# EasyEDA Pro project codeday-badge.eprj, schematic CodeDay Badge

## Sheets
1 RF: Create Date: 2023-02-03; Page Name: RF; Project Name: codeday-badge; Schematic Name: CodeDay Badge; Update Date: 2023-03-01; Company: EasyEDA.com; Drawed: EasyEDA Pro; Page Size: A4; Part Number: JLCPCB-002; Reviewed: EasyEDA Pro; Version: V0.1
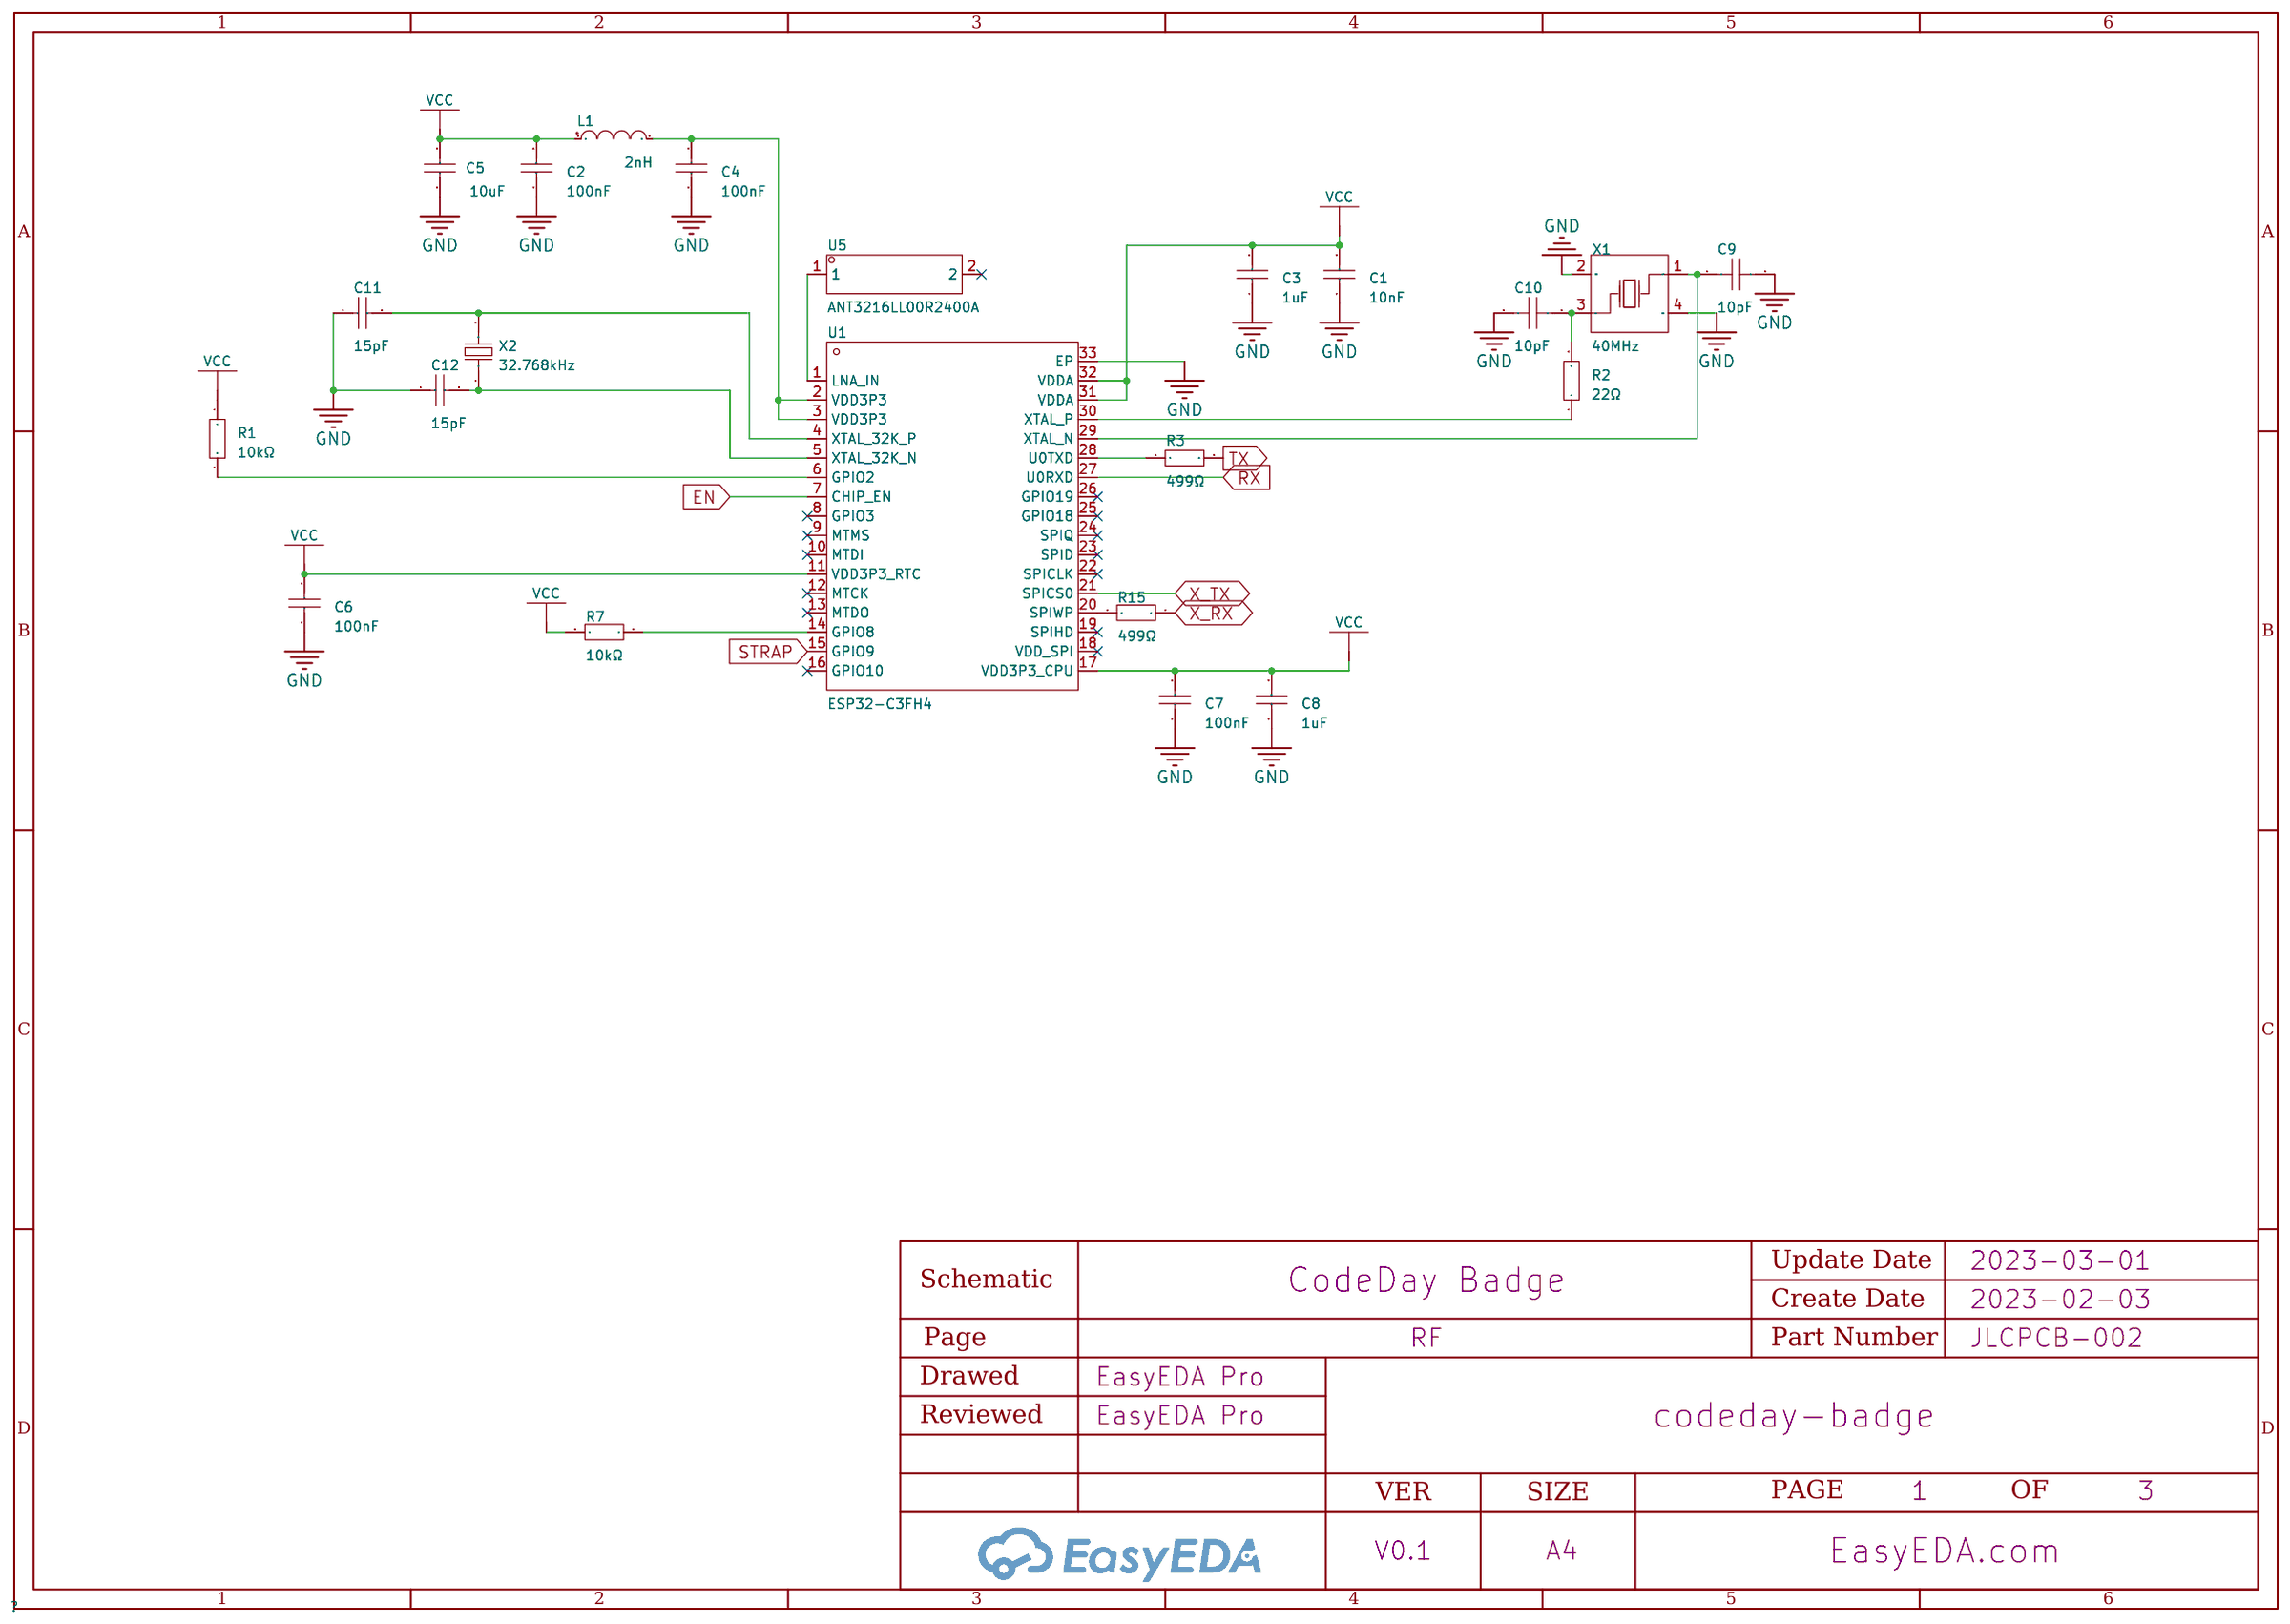
[diagram p0: RF]
2 LED: Create Date: 2023-02-28; Page Name: LED; Company: CQP LLC; Drawed: Tyler Menezes; Reviewed: Tyler Menezes; Version: V1.0
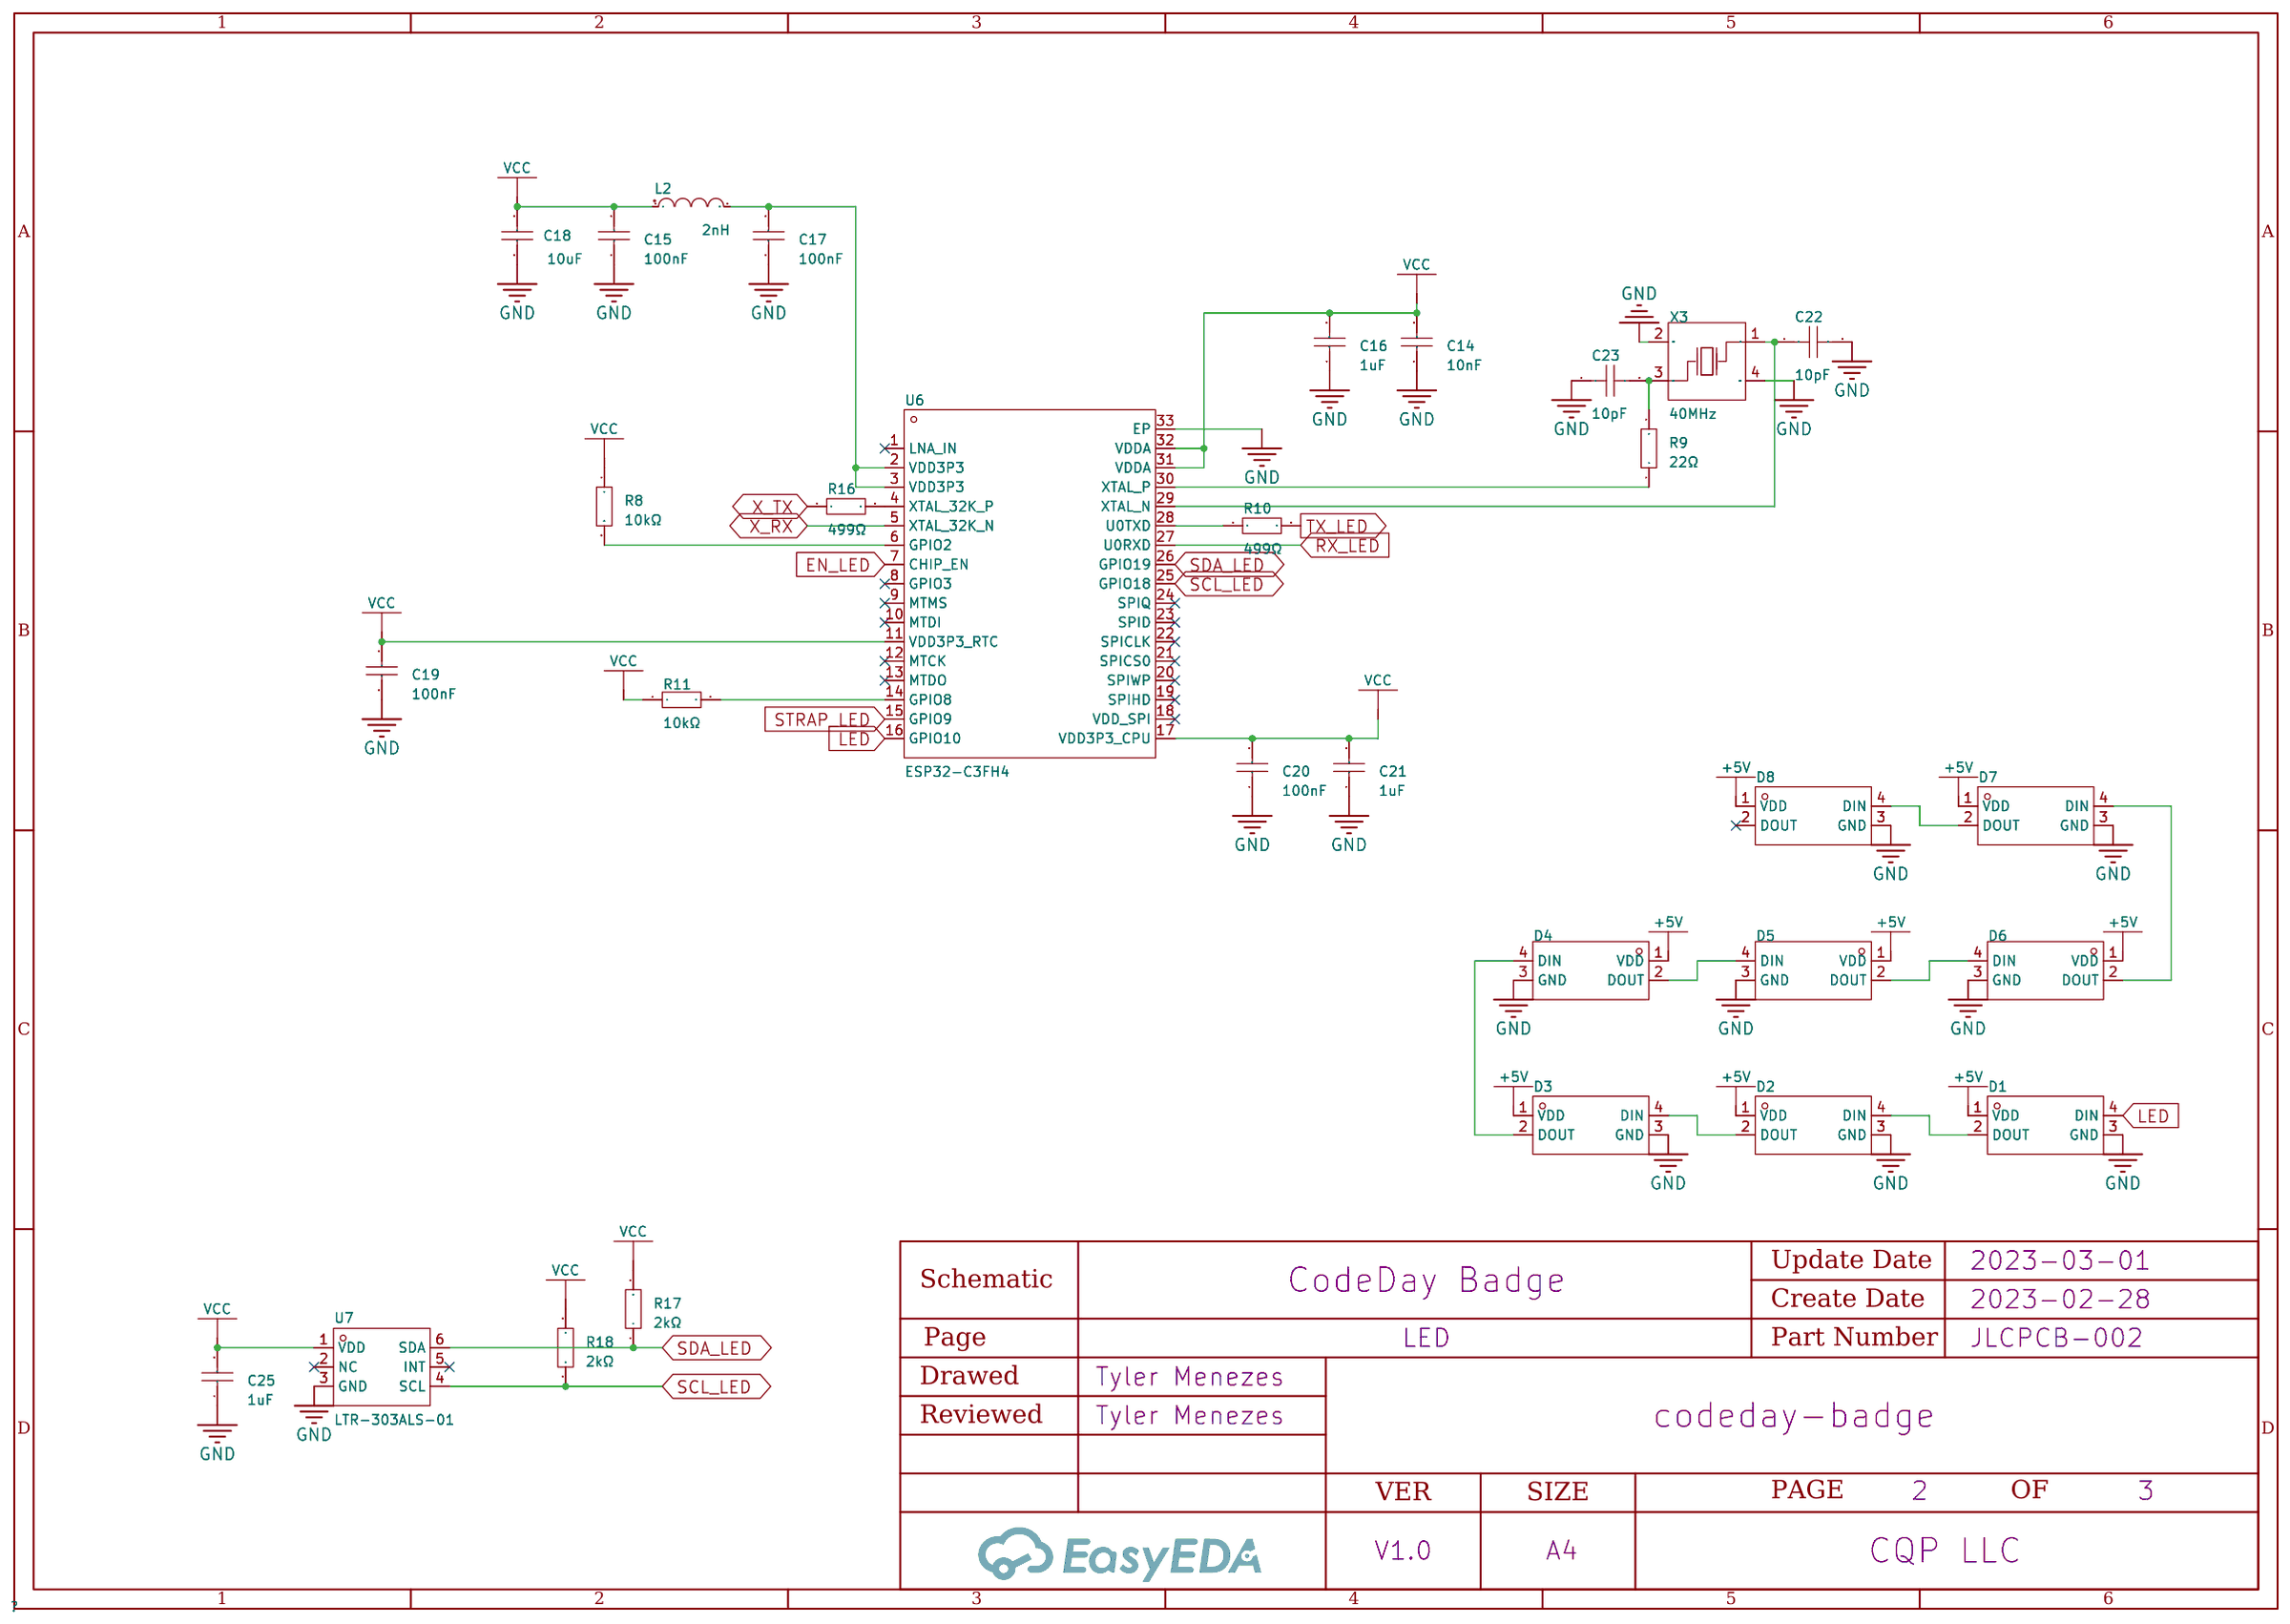
[diagram p1: LED]
3 IO Power: Create Date: 2023-03-01; Page Name: IO Power; Company: CQP LLC; Drawed: Tyler Menezes; Reviewed: Tyler Menezes; Version: V1.0
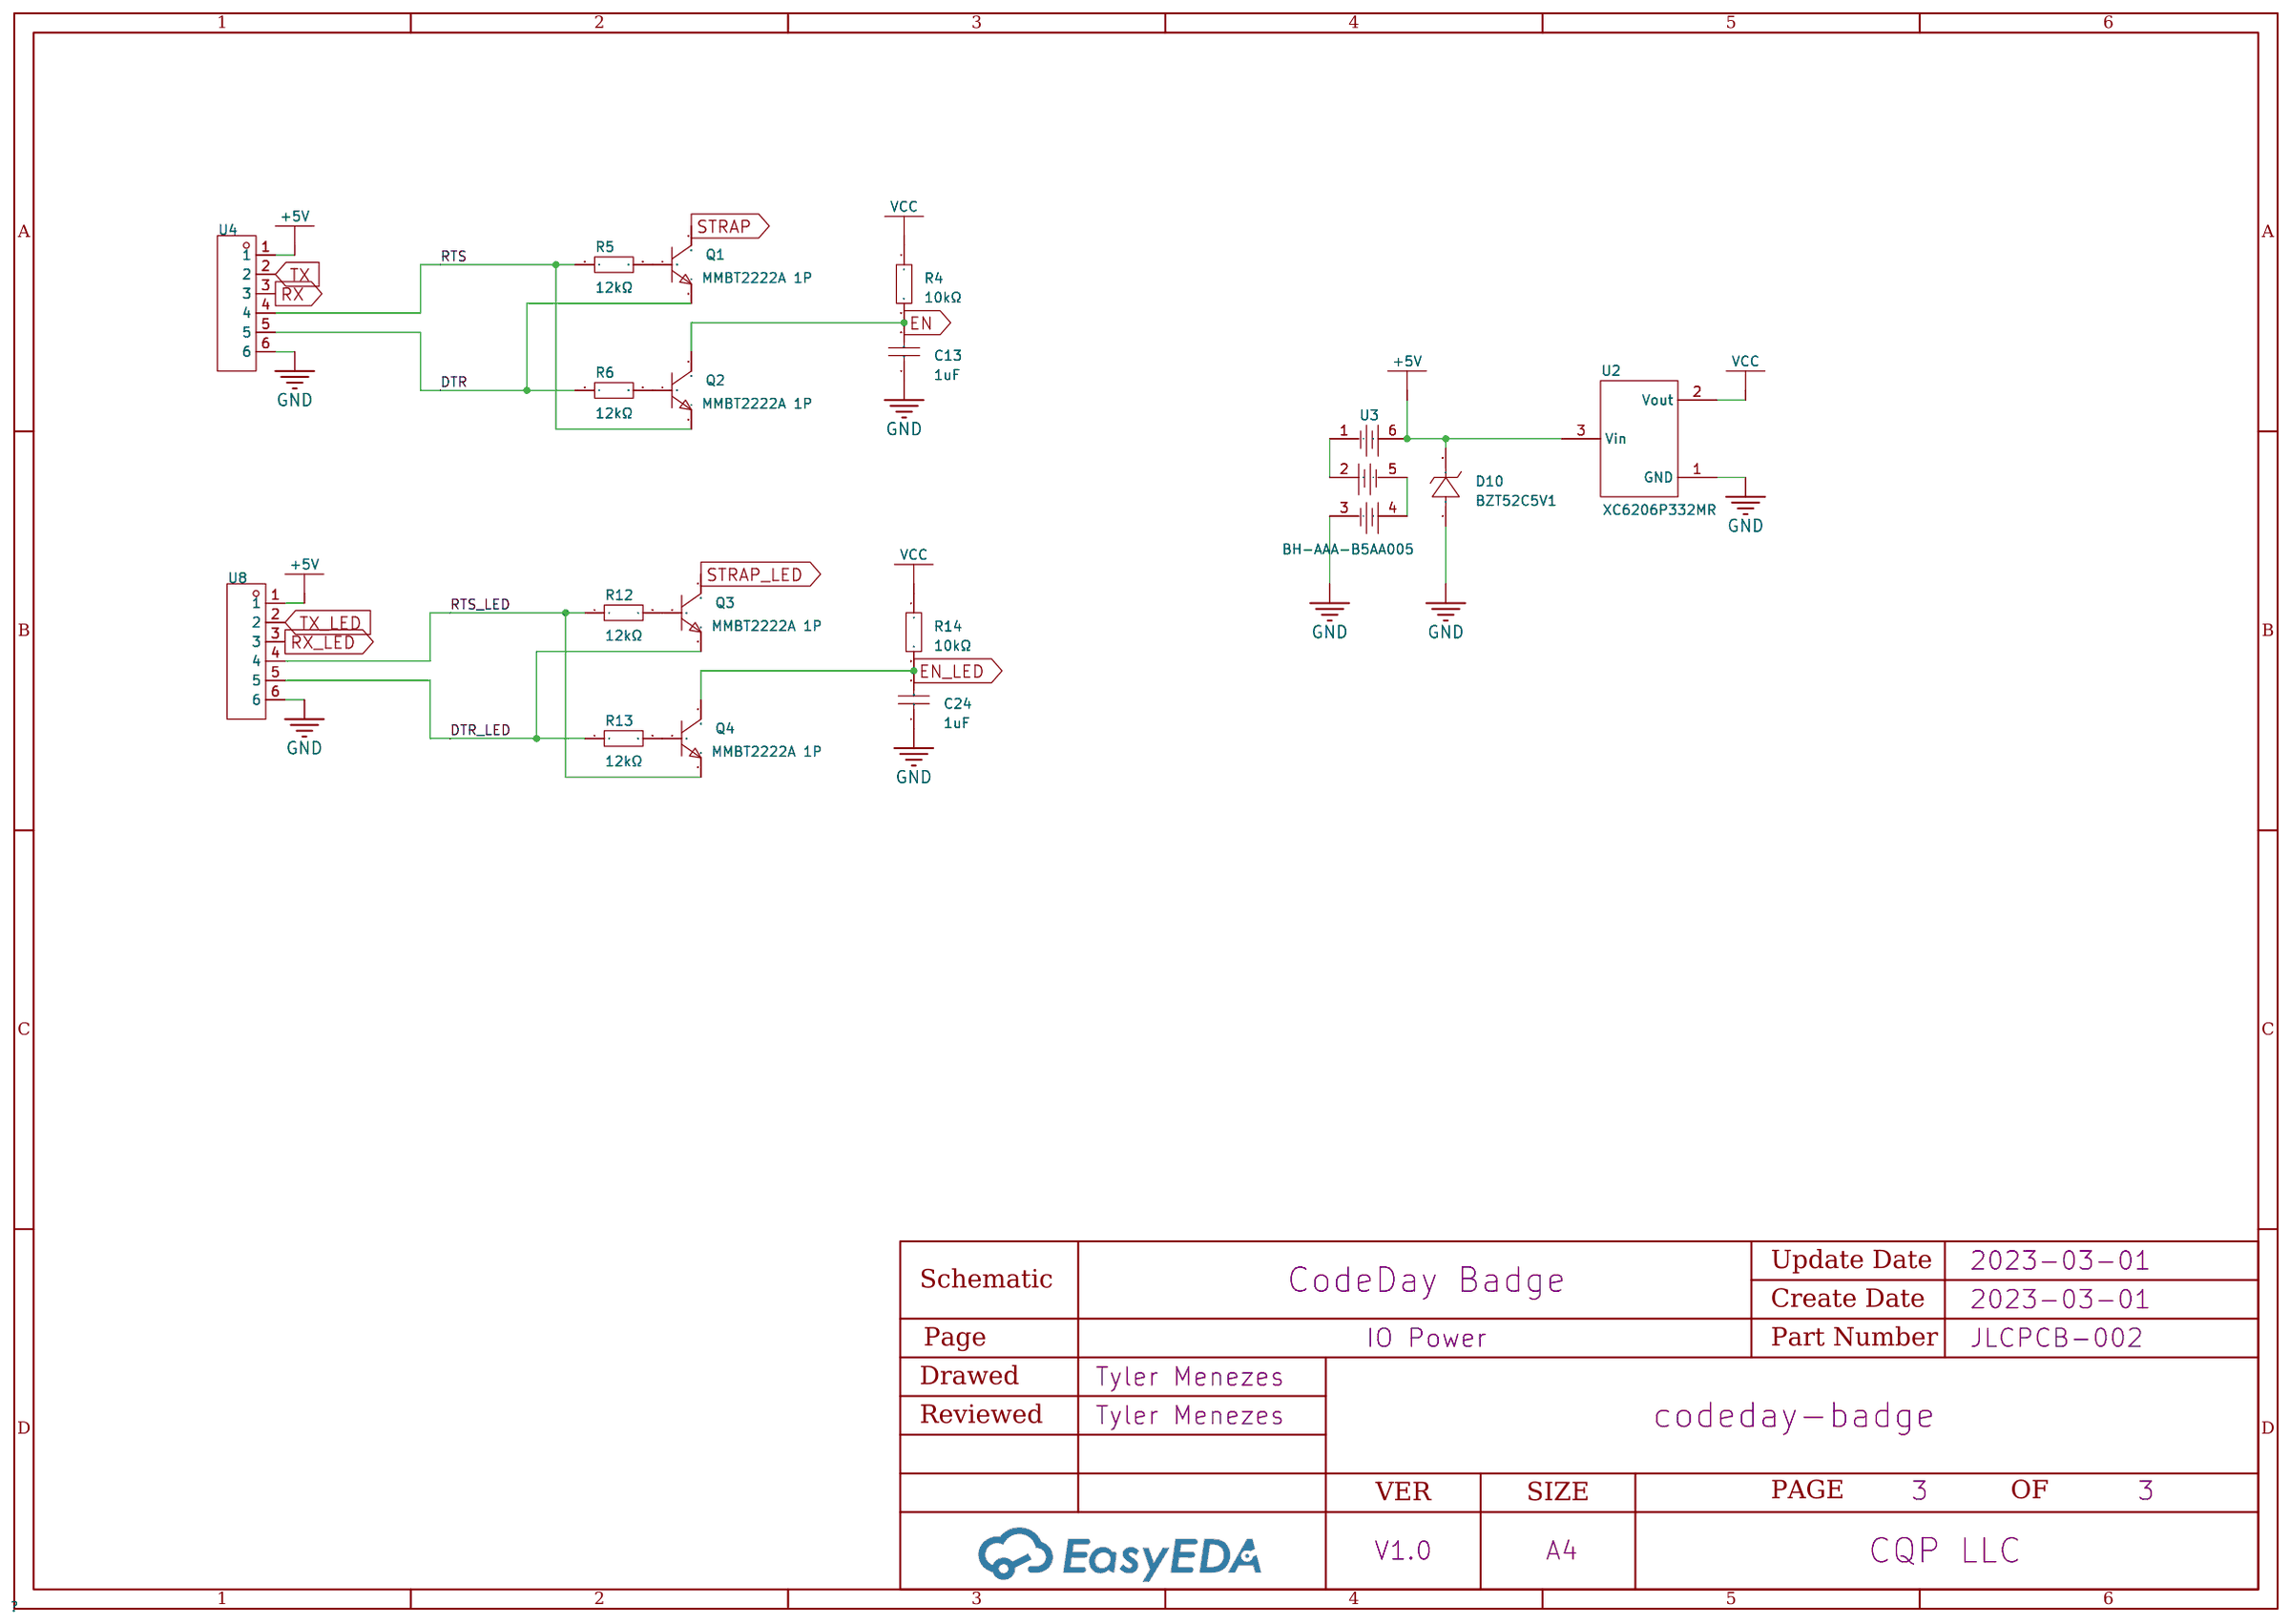
[diagram p2: IO Power]

## Parts
sheet IO Power
C13  1uF  [C0603]
C24  1uF  [C0603]
D10  BZT52C5V1  [SOD-123_L2.7-W1.6-LS3.7-R-RD]
Q1  MMBT2222A 1P  [SOT-23-3_L2.9-W1.3-P1.90-LS2.4-BR]
Q2  MMBT2222A 1P  [SOT-23-3_L2.9-W1.3-P1.90-LS2.4-BR]
Q3  MMBT2222A 1P  [SOT-23-3_L2.9-W1.3-P1.90-LS2.4-BR]
Q4  MMBT2222A 1P  [SOT-23-3_L2.9-W1.3-P1.90-LS2.4-BR]
R4  10kΩ  [R0402]
R5  12kΩ  [R0402]
R6  12kΩ  [R0402]
R12  12kΩ  [R0402]
R13  12kΩ  [R0402]
R14  10kΩ  [R0402]
U2  XC6206P332MR  [SOT-23-3_L2.9-W1.6-P1.90-LS2.8-BR]
U3  BH-AAA-B5AA005  [BAT-SMD_BH-AAA-B5AA005]
U4  ad8fa1fdb8d44eac8dc13500dd650be4  [HDR-TH_6P-P2.54-V-M-A]
U8  ad8fa1fdb8d44eac8dc13500dd650be4  [HDR-TH_6P-P2.54-V-M-A]
sheet LED
C14  10nF  [C0402]
C15  100nF  [C0402_NEW]
C16  1uF  [C0603]
C17  100nF  [C0402_NEW]
C18  10uF  [C0402]
C19  100nF  [C0402_NEW]
C20  100nF  [C0402_NEW]
C21  1uF  [C0603]
C22  10pF  [C0402]
C23  10pF  [C0402]
C25  1uF  [C0603]
D1  XL-0807RGBC-WS2812B  [LED-SMD_4P-L2.0-W1.8_CY-0807]
D2  XL-0807RGBC-WS2812B  [LED-SMD_4P-L2.0-W1.8_CY-0807]
D3  XL-0807RGBC-WS2812B  [LED-SMD_4P-L2.0-W1.8_CY-0807]
D4  XL-0807RGBC-WS2812B  [LED-SMD_4P-L2.0-W1.8_CY-0807]
D5  XL-0807RGBC-WS2812B  [LED-SMD_4P-L2.0-W1.8_CY-0807]
D6  XL-0807RGBC-WS2812B  [LED-SMD_4P-L2.0-W1.8_CY-0807]
D7  XL-0807RGBC-WS2812B  [LED-SMD_4P-L2.0-W1.8_CY-0807]
D8  XL-0807RGBC-WS2812B  [LED-SMD_4P-L2.0-W1.8_CY-0807]
L2  2nH  [L0402-RD]
R8  10kΩ  [R0402]
R9  22Ω  [R0603]
R10  499Ω  [R0402]
R11  10kΩ  [R0402]
R16  499Ω  [R0402]
R17  2kΩ  [R0402]
R18  2kΩ  [R0402]
U6  ESP32-C3FH4  [QFN-32_L5.0-W5.0-P0.50-TL-EP3.7]
U7  LTR-303ALS-01  [SOT-363_L2.0-W1.3-P0.65-LS2.1-BL]
X3  40MHz  [CRYSTAL-SMD_4P-L2.5-W2.0-BL]
sheet RF
C1  10nF  [C0402]
C2  100nF  [C0402_NEW]
C3  1uF  [C0603]
C4  100nF  [C0402_NEW]
C5  10uF  [C0402]
C6  100nF  [C0402_NEW]
C7  100nF  [C0402_NEW]
C8  1uF  [C0603]
C9  10pF  [C0402]
C10  10pF  [C0402]
C11  15pF  [C0603]
C12  15pF  [C0603]
L1  2nH  [L0402-RD]
R1  10kΩ  [R0402]
R2  22Ω  [R0603]
R3  499Ω  [R0402]
R7  10kΩ  [R0402]
R15  499Ω  [R0402]
U1  ESP32-C3FH4  [QFN-32_L5.0-W5.0-P0.50-TL-EP3.7]
U5  ANT3216LL00R2400A  [ANT-SMD_L3.2-W1.6]
X1  40MHz  [CRYSTAL-SMD_4P-L2.5-W2.0-BL]
X2  32.768kHz  [FC-135R_L3.2-W1.5]

## Library data of the parts
C3 C8 C13 C16 C21 C24 C25 = CL10A105KB8NNNC: Capacitance: Tolerance:±10% Tolerance:±10% Voltage Rated: Temperature Coefficient:; LCSC Part Name: 1uF ±10% 50V; Supplier Part: C15849; Manufacturer: SAMSUNG(三星); Supplier Footprint: 0603; Datasheet: https://atta.szlcsc.com/upload/public/pdf/source/20160103/1457707679084.pdf; Supplier: LCSC; Tolerance: ±10%; Check: true
D10 = BZT52C5V1_C2891773: Diode Configuration:- Zener Voltage (Nom):5.1V Zener Voltage (Range):5.1V~5.4V Zener Voltage (Range):5.1V~5.4V Power Dissipation:500mW Reverse Leakage Current (Ir):2uA@2V Zener Impedance (Zzt):60Ω; LCSC Part Name: 5.1V 500mW; Supplier Part: C2891773; Manufacturer: YONGYUTAI(永裕泰); Supplier Footprint: SOD-123; JLCPCB Part Class: Extended Part; Datasheet: https://atta.szlcsc.com/upload/public/pdf/source/20210901/8FC2376A01E96D0346FF8B134DC7A446.pdf; Supplier: LCSC; Zener Voltage (Nom): 5.1V; Zener Voltage (Range): 5.1V~5.4V; Power Dissipation: 500mW; Reverse Leakage Current (Ir): 2uA@2V; Zener Impedance (Zzt): 60Ω
Q1-Q4 = MMBT2222A 1P_C8512: Transistor Type: Collector-Emitter Breakdown Voltage (Vceo): Collector Current (Ic): Power Dissipation (Pd): Collector Cut-Off Current (Icbo):10nA Collector-Emitter Saturation Voltage (VCE(sat)@Ic,Ib):1V@500mA,50mA Transition Frequency (fT):300MHz Operati; LCSC Part Name: NPN 40V 600mA; Supplier Part: C8512; Manufacturer: CJ(江苏长电/长晶); Supplier Footprint: SOT-23; JLCPCB Part Class: Basic Part; Datasheet: https://atta.szlcsc.com/upload/public/pdf/source/20140815/1457707223705.pdf; Supplier: LCSC; Collector Cut-Off Current (Icbo): 10nA; Collector-Emitter Saturation Voltage (VCE(sat)@Ic,Ib): 1V@500mA,50mA; Transition Frequency (fT): 300MHz; Operating Temperature: +150℃@(Tj)
R1 R4 R7 R8 R11 R14 = 0402WGF1002TCE: Type:Thick Film Resistors Resistance: Tolerance:±1% Tolerance:±1% Power(Watts): Temperature Coefficient:±100ppm/℃ Temperature Coefficient:±100ppm/℃ Overload Voltage (Max): Operating Temperature Range:-55℃~+155℃ Operating Temperature Range:-55℃~+155℃; LCSC Part Name: 10kΩ ±1% 62.5mW; Supplier Part: C25744; Manufacturer: UNI-ROYAL(厚声); Supplier Footprint: 0402; Datasheet: https://atta.szlcsc.com/upload/public/pdf/source/20200306/C422600_1E6D84923E4A46A82E41ADD87F860B5C.pdf; Supplier: LCSC; Type: Thick Film Resistors; Tolerance: ±1%; Temperature Coefficient: ±100ppm/℃; Operating Temperature Range: -55℃~+155℃; Check: true
R5 R6 R12 R13 = 0402WGF1202TCE: Type:Thick Film Resistors Resistance: Tolerance:±1% Tolerance:±1% Power(Watts): Temperature Coefficient:±100ppm/℃ Temperature Coefficient:±100ppm/℃ Overload Voltage (Max): Operating Temperature Range:-55℃~+155℃ Operating Temperature Range:-55℃~+155℃; LCSC Part Name: 12kΩ ±1% 62.5mW; Supplier Part: C25752; Manufacturer: UNI-ROYAL(厚声); Supplier Footprint: 0402; JLCPCB Part Class: Basic Part; Datasheet: https://atta.szlcsc.com/upload/public/pdf/source/20200306/C422600_1E6D84923E4A46A82E41ADD87F860B5C.pdf; Supplier: LCSC; Type: Thick Film Resistors; Tolerance: ±1%; Temperature Coefficient: ±100ppm/℃; Operating Temperature Range: -55℃~+155℃
U2 = XC6206P332MR_C5446: Output Type: Output Polarity:Positive Number of Outputs:1 Maximum Input Voltage:6V Output Voltage:3.3V~3.3V Output Voltage:3.3V~3.3V Dropout Voltage:680mV@(100mA) Output Current:200mA Power Supply Rejection Ratio (PSRR):-; LCSC Part Name: 正 Vin=6V Vout=3.3V 200mA; Supplier Part: C5446; Manufacturer: TOREX(特瑞仕); Supplier Footprint: SOT-23-3L; JLCPCB Part Class: Basic Part; Datasheet: https://atta.szlcsc.com/upload/public/pdf/source/20130801/1457706628791.pdf; Supplier: LCSC; Output Polarity: Positive; Number of Outputs: 1; Maximum Input Voltage: 6V; Output Voltage: 3.3V~3.3V; Dropout Voltage: 680mV@(100mA); Output Current: 200mA; Check: true
U3 = BH-AAA-B5AA005: Supplier Part: C2979170; Manufacturer: MYOUNG(美阳); Supplier Footprint: SMD; JLCPCB Part Class: Extended Part; Datasheet: https://atta.szlcsc.com/upload/public/pdf/source/20221013/FFE94A8969B5D340880A7812F55073DB.pdf; Supplier: LCSC
U4 U8 = 长排针,2.54mm,6p: Supplier Part: C9900021383; Supplier Footprint: HDR-TH_6P-P2.54-V-M; Datasheet: https://atta.szlcsc.comnull; Supplier: LCSC
C1 C14 = CL05B103KB5NNNC: Capacitance: Tolerance:±10% Tolerance:±10% Voltage Rated: Temperature Coefficient:; LCSC Part Name: 10nF ±10% 50V; Supplier Part: C15195; Manufacturer: SAMSUNG(三星); Supplier Footprint: 0402; Datasheet: https://atta.szlcsc.com/upload/public/pdf/source/20160103/1457707674468.pdf; Supplier: LCSC; Tolerance: ±10%; Check: true
C2 C4 C6 C7 C15 C17 C19 C20 = CL05B104KO5NNNC: Capacitance: Tolerance:±10% Tolerance:±10% Voltage Rated: Temperature Coefficient:; LCSC Part Name: 100nF ±10% 16V; Supplier Part: C1525; Manufacturer: SAMSUNG(三星); Supplier Footprint: 0402; JLCPCB Part Class: Basic Part; Datasheet: https://atta.szlcsc.com/upload/public/pdf/source/20160103/1457707674891.pdf; Supplier: LCSC; Tolerance: ±10%; Check: true
C5 C18 = CL05A106MQ5NUNC: Capacitance: Tolerance:±20% Tolerance:±20% Voltage Rated: Temperature Coefficient:; LCSC Part Name: 10uF ±20% 6.3V; Supplier Part: C15525; Manufacturer: SAMSUNG(三星); Supplier Footprint: 0402; Datasheet: https://atta.szlcsc.com/upload/public/pdf/source/20220823/2B02EE04F8F211D38A52DCB16EB6BEBA.pdf; Supplier: LCSC; Tolerance: ±20%; Check: true
C9 C10 C22 C23 = CL05C100JB5NNNC: Capacitance: Tolerance:±5% Tolerance:±5% Voltage Rated: Temperature Coefficient:; LCSC Part Name: 10pF ±5% 50V; Supplier Part: C32949; Manufacturer: SAMSUNG(三星); Supplier Footprint: 0402; Datasheet: https://atta.szlcsc.com/upload/public/pdf/source/20160103/1457707722238.pdf; Supplier: LCSC; Tolerance: ±5%; Check: true
D1-D8 = XL-0807RGBC-WS2812B: Emitted Color:RGB Diode Configuration:- Lens Color:Colorless Dominant Wavelength:- Dominant Wavelength:- Peak Wavelength:- Color Temperature:- Color Temperature:- Luminous Flux (@25℃):- Luminous Flux (@25℃):- Forward Current:20mA Forward Voltage (VF):3.5V; LCSC Part Name: RGB三色 正贴; Supplier Part: C3646929; Manufacturer: XINGLIGHT(成兴光); Supplier Footprint: SMD,1.8x2mm; Datasheet: https://atta.szlcsc.com/upload/public/pdf/source/20220704/8AC05C59AC3A71CCA97D1D2180172B1A.pdf; Supplier: LCSC; Emitted Color: RGB; Lens Color: Colorless; Forward Current: 20mA; Forward Voltage (VF): 3.5V~5.5V; Viewing Angle: 120°; Mounting Sytle: Positive post; Operating Temperature: -40℃~+150℃
L1 L2 = MLG1005S2N0BTD25: Height:- Frequency - Self Resonant: Length:- Q @ Freq: Width:- Rated Current: Ratings: Saturation Current (Isat):- DC Resistance (DCR): Inductance: Tolerance: Tolerance:; LCSC Part Name: 2.0nH ±0.1nH; Supplier Part: C404617; Manufacturer: TDK; Supplier Footprint: 0402; Datasheet: https://atta.szlcsc.com/upload/public/pdf/source/20190827/C404617_8B3FD7F6014F142EA9A8EC842B4051C3.pdf; Supplier: LCSC; Check: true
R2 R9 = 0603WAF220JT5E: Type:Thick Film Resistors Resistance: Tolerance:±1% Tolerance:±1% Power(Watts): Temperature Coefficient:±100ppm/℃ Temperature Coefficient:±100ppm/℃ Overload Voltage (Max): Operating Temperature Range:-55℃~+155℃ Operating Temperature Range:-55℃~+155℃; LCSC Part Name: 22Ω ±1% 100mW; Supplier Part: C23345; Manufacturer: UNI-ROYAL(厚声); Supplier Footprint: 0603; Datasheet: https://atta.szlcsc.com/upload/public/pdf/source/20200306/C422600_1E6D84923E4A46A82E41ADD87F860B5C.pdf; Supplier: LCSC; Type: Thick Film Resistors; Tolerance: ±1%; Temperature Coefficient: ±100ppm/℃; Operating Temperature Range: -55℃~+155℃; Check: true
R3 R10 R15 R16 = RC0402FR-07499RL: Type:Thick Film Resistors Resistance: Tolerance:±1% Tolerance:±1% Power(Watts): Temperature Coefficient:±100ppm/℃ Temperature Coefficient:±100ppm/℃ Overload Voltage (Max): Operating Temperature Range:-55℃~+155℃ Operating Temperature Range:-55℃~+155℃; LCSC Part Name: 499Ω ±1% 62.5mW; Supplier Part: C137970; Manufacturer: YAGEO(国巨); Supplier Footprint: 0402; Datasheet: https://atta.szlcsc.com/upload/public/pdf/source/20171107/C137970_15100516073541096898.pdf; Supplier: LCSC; Type: Thick Film Resistors; Tolerance: ±1%; Temperature Coefficient: ±100ppm/℃; Operating Temperature Range: -55℃~+155℃
R17 R18 = 0402WGF2001TCE: Type:Thick Film Resistors Resistance: Tolerance:±1% Tolerance:±1% Power(Watts): Temperature Coefficient:±100ppm/℃ Temperature Coefficient:±100ppm/℃ Overload Voltage (Max): Operating Temperature Range:-55℃~+155℃ Operating Temperature Range:-55℃~+155℃; LCSC Part Name: 2kΩ ±1% 62.5mW; Supplier Part: C4109; Manufacturer: UNI-ROYAL(厚声); Supplier Footprint: 0402; Datasheet: https://atta.szlcsc.com/upload/public/pdf/source/20200306/C422600_1E6D84923E4A46A82E41ADD87F860B5C.pdf; Supplier: LCSC; Type: Thick Film Resistors; Tolerance: ±1%; Temperature Coefficient: ±100ppm/℃; Operating Temperature Range: -55℃~+155℃
U1 U6 = ESP32-C3FH4: Supplier Part: C2858491; Manufacturer: ESPRESSIF(乐鑫); Supplier Footprint: QFN-32; JLCPCB Part Class: Extended Part; Datasheet: https://atta.szlcsc.com/upload/public/pdf/source/20210726/B8823F05EB5B1ECA99D4F01661A43FA8.pdf; Supplier: LCSC; Check: true
U7 = LTR-303ALS-01: Supplier Part: C364577; Manufacturer: LITEON(光宝); Supplier Footprint: SMD; JLCPCB Part Class: Extended Part; Datasheet: https://atta.szlcsc.com/upload/public/pdf/source/20190228/C364577_22D9C2451404EB1C918B95CD5CAED65B.pdf; Supplier: LCSC
X1 X3 = X2B040000BF1H-HT: Frequency Tolerance: Frequency Tolerance: Operating Temperature: Operating Temperature: Frequency: Crystal Type: Equivalent Series Resistance (ESR): Load Capacitance:; LCSC Part Name: HSX221S 40.000MHZ 15PF ±10PPM; Supplier Part: C254290; Manufacturer: HELE(台湾加高); Supplier Footprint: SMD-2520; Datasheet: https://atta.szlcsc.com/upload/public/pdf/source/20190701/C254290_BCE9F366A77DE53BD3AA5DC118D2929A.pdf; Supplier: LCSC; Check: true
C11 C12 = CL10C150JB8NNNC: Capacitance: Tolerance:±5% Tolerance:±5% Voltage Rated: Temperature Coefficient:; LCSC Part Name: 15pF ±5% 50V; Supplier Part: C1644; Manufacturer: SAMSUNG(三星); Supplier Footprint: 0603; JLCPCB Part Class: Basic Part; Datasheet: https://atta.szlcsc.com/upload/public/pdf/source/20160103/1457707686387.pdf; Supplier: LCSC; Tolerance: ±5%
U5 = ANT3216LL00R2400A: Supplier Part: C293767; Manufacturer: YAGEO(国巨); Supplier Footprint: 1206; JLCPCB Part Class: Extended Part; Datasheet: https://atta.szlcsc.com/upload/public/pdf/source/20181012/C293767_CDE82A2F74DC82A94DB708CB53B68F23.pdf; Supplier: LCSC
X2 = Q13FC1350000400: Crystal Type:SMD Crystal Resonator Frequency: Frequency Tolerance:±20ppm Frequency Tolerance:±20ppm Load Capacitance: Equivalent Series Resistance (ESR):70kΩ Operating Temperature: Operating Temperature:; LCSC Part Name: 32.768kHz ±20ppm 12.5pF; Supplier Part: C32346; Manufacturer: EPSON(爱普生); Supplier Footprint: SMD3215-2P; JLCPCB Part Class: Basic Part; Datasheet: https://atta.szlcsc.com/upload/public/pdf/source/20190108/C32346_746D6B07EAF90824457A96480007685F.pdf; Supplier: LCSC; Crystal Type: SMD Crystal Resonator; Frequency Tolerance: ±20ppm; Equivalent Series Resistance (ESR): 70kΩ

## Nets
+5V: D1.1(VDD) D2.1(VDD) D3.1(VDD) D4.1(VDD) D5.1(VDD) D6.1(VDD) D7.1(VDD) D8.1(VDD) D10.2(K) U2.3(Vin) U3.6(+) U4.1 U8.1
GND: C1.1 C2.1 C3.1 C4.1 C5.1 C6.1 C7.1 C8.1 C9.2 C10.1 C11.1 C12.1 C13.1 C14.1 C15.1 C16.1 C17.1 C18.1 C19.1 C20.1 C21.1 C22.2 C23.1 C24.1 C25.1 D1.3(GND) D2.3(GND) D3.3(GND) D4.3(GND) D5.3(GND) D6.3(GND) D7.3(GND) D8.3(GND) D10.1(A) U1.33(EP) U2.1(GND) U3.3(-) U4.6 U6.33(EP) U7.3(GND) U8.6 X1.2(GND/Lid) X1.4(GND/Lid) X3.2(GND/Lid) X3.4(GND/Lid)
VCC: C1.2 C2.2 C3.2 C5.2 C6.2 C7.2 C8.2 C14.2 C15.2 C16.2 C18.2 C19.2 C20.2 C21.2 C25.2 L1.1 L2.1 R1.1 R4.1 R7.1 R8.1 R11.1 R14.1 R17.2 R18.2 U1.11(VDD3P3_RTC) U1.17(VDD3P3_CPU) U1.31(VDDA) U1.32(VDDA) U2.2(Vout) U6.11(VDD3P3_RTC) U6.17(VDD3P3_CPU) U6.31(VDDA) U6.32(VDDA) U7.1(VDD)
DTR: Q1.2(E) R6.1 U4.5
DTR_LED: Q3.2(E) R13.1 U8.5
EN: C13.2 Q2.3(C) R4.2 U1.7(CHIP_EN)
EN_LED: C24.2 Q4.3(C) R14.2 U6.7(CHIP_EN)
LED: D1.4(DIN) U6.16(GPIO10)
RTS: Q2.2(E) R5.1 U4.4
RTS_LED: Q4.2(E) R12.1 U8.4
RX: U1.27(U0RXD) U4.3
RX_LED: U6.27(U0RXD) U8.3
SCL_LED: R18.1 U6.25(GPIO18) U7.4(SCL)
SDA_LED: R17.1 U6.26(GPIO19) U7.6(SDA)
STRAP: Q1.3(C) U1.15(GPIO9)
STRAP_LED: Q3.3(C) U6.15(GPIO9)
TX: R3.2 U4.2
TX_LED: R10.2 U8.2
X_RX: R15.1 U6.5(XTAL_32K_N)
X_TX: R16.1 U1.21(SPICS0)
$4N1420: C4.2 L1.2 U1.2(VDD3P3) U1.3(VDD3P3)
$4N2104: R1.2 U1.6(GPIO2)
$4N4744: C9.1 U1.29(XTAL_N) X1.1(OSC1)
$4N6093: C10.2 R2.2 X1.3(OSC2)
$4N6163: R2.1 U1.30(XTAL_P)
$4N9588: C11.2 U1.4(XTAL_32K_P) X2.2
$4N9606: C12.2 U1.5(XTAL_32K_N) X2.1
$4N10792: R3.1 U1.28(U0TXD)
$4N18905: R7.2 U1.14(GPIO8)
$4N19208: U1.1(LNA_IN) U5.1
$4N36490: R15.2 U1.20(SPIWP)
$7N1471: C23.2 R9.2 X3.3(OSC2)
$7N1472: C22.1 U6.29(XTAL_N) X3.1(OSC1)
$7N1473: R9.1 U6.30(XTAL_P)
$7N1477: C17.2 L2.2 U6.2(VDD3P3) U6.3(VDD3P3)
$7N1480: R10.1 U6.28(U0TXD)
$7N1488: R8.2 U6.6(GPIO2)
$7N1489: R11.2 U6.14(GPIO8)
$7N7409: D1.2(DOUT) D2.4(DIN)
$7N7410: D2.2(DOUT) D3.4(DIN)
$7N7411: D3.2(DOUT) D4.4(DIN)
$7N7412: D4.2(DOUT) D5.4(DIN)
$7N7413: D5.2(DOUT) D6.4(DIN)
$7N7414: D6.2(DOUT) D7.4(DIN)
$7N7767: D7.2(DOUT) D8.4(DIN)
$7N7899: R16.2 U6.4(XTAL_32K_P)
$8N431: Q1.1(B) R5.2
$8N432: Q2.1(B) R6.2
$8N941: U3.4(+) U3.5(-)
$8N942: U3.1(-) U3.2(+)
$8N1473: Q3.1(B) R12.2
$8N1474: Q4.1(B) R13.2

Not connected (* = marked no-connect by the designer): D8 2(DOUT)*; U1 8(GPIO3)* 9(MTMS)* 10(MTDI)* 12(MTCK)* 13(MTDO)* 16(GPIO10)* 18(VDD_SPI)* 19(SPIHD)* 22(SPICLK)* 23(SPID)* 24(SPIQ)* 25(GPIO18)* 26(GPIO19)*; U5 2*; U6 1(LNA_IN)* 8(GPIO3)* 9(MTMS)* 10(MTDI)* 12(MTCK)* 13(MTDO)* 18(VDD_SPI)* 19(SPIHD)* 20(SPIWP)* 21(SPICS0)* 22(SPICLK)* 23(SPID)* 24(SPIQ)*; U7 2(NC)* 5(INT)*
